# EAGLE design ESP-wroom-02U (EAGLE 9.6.2)
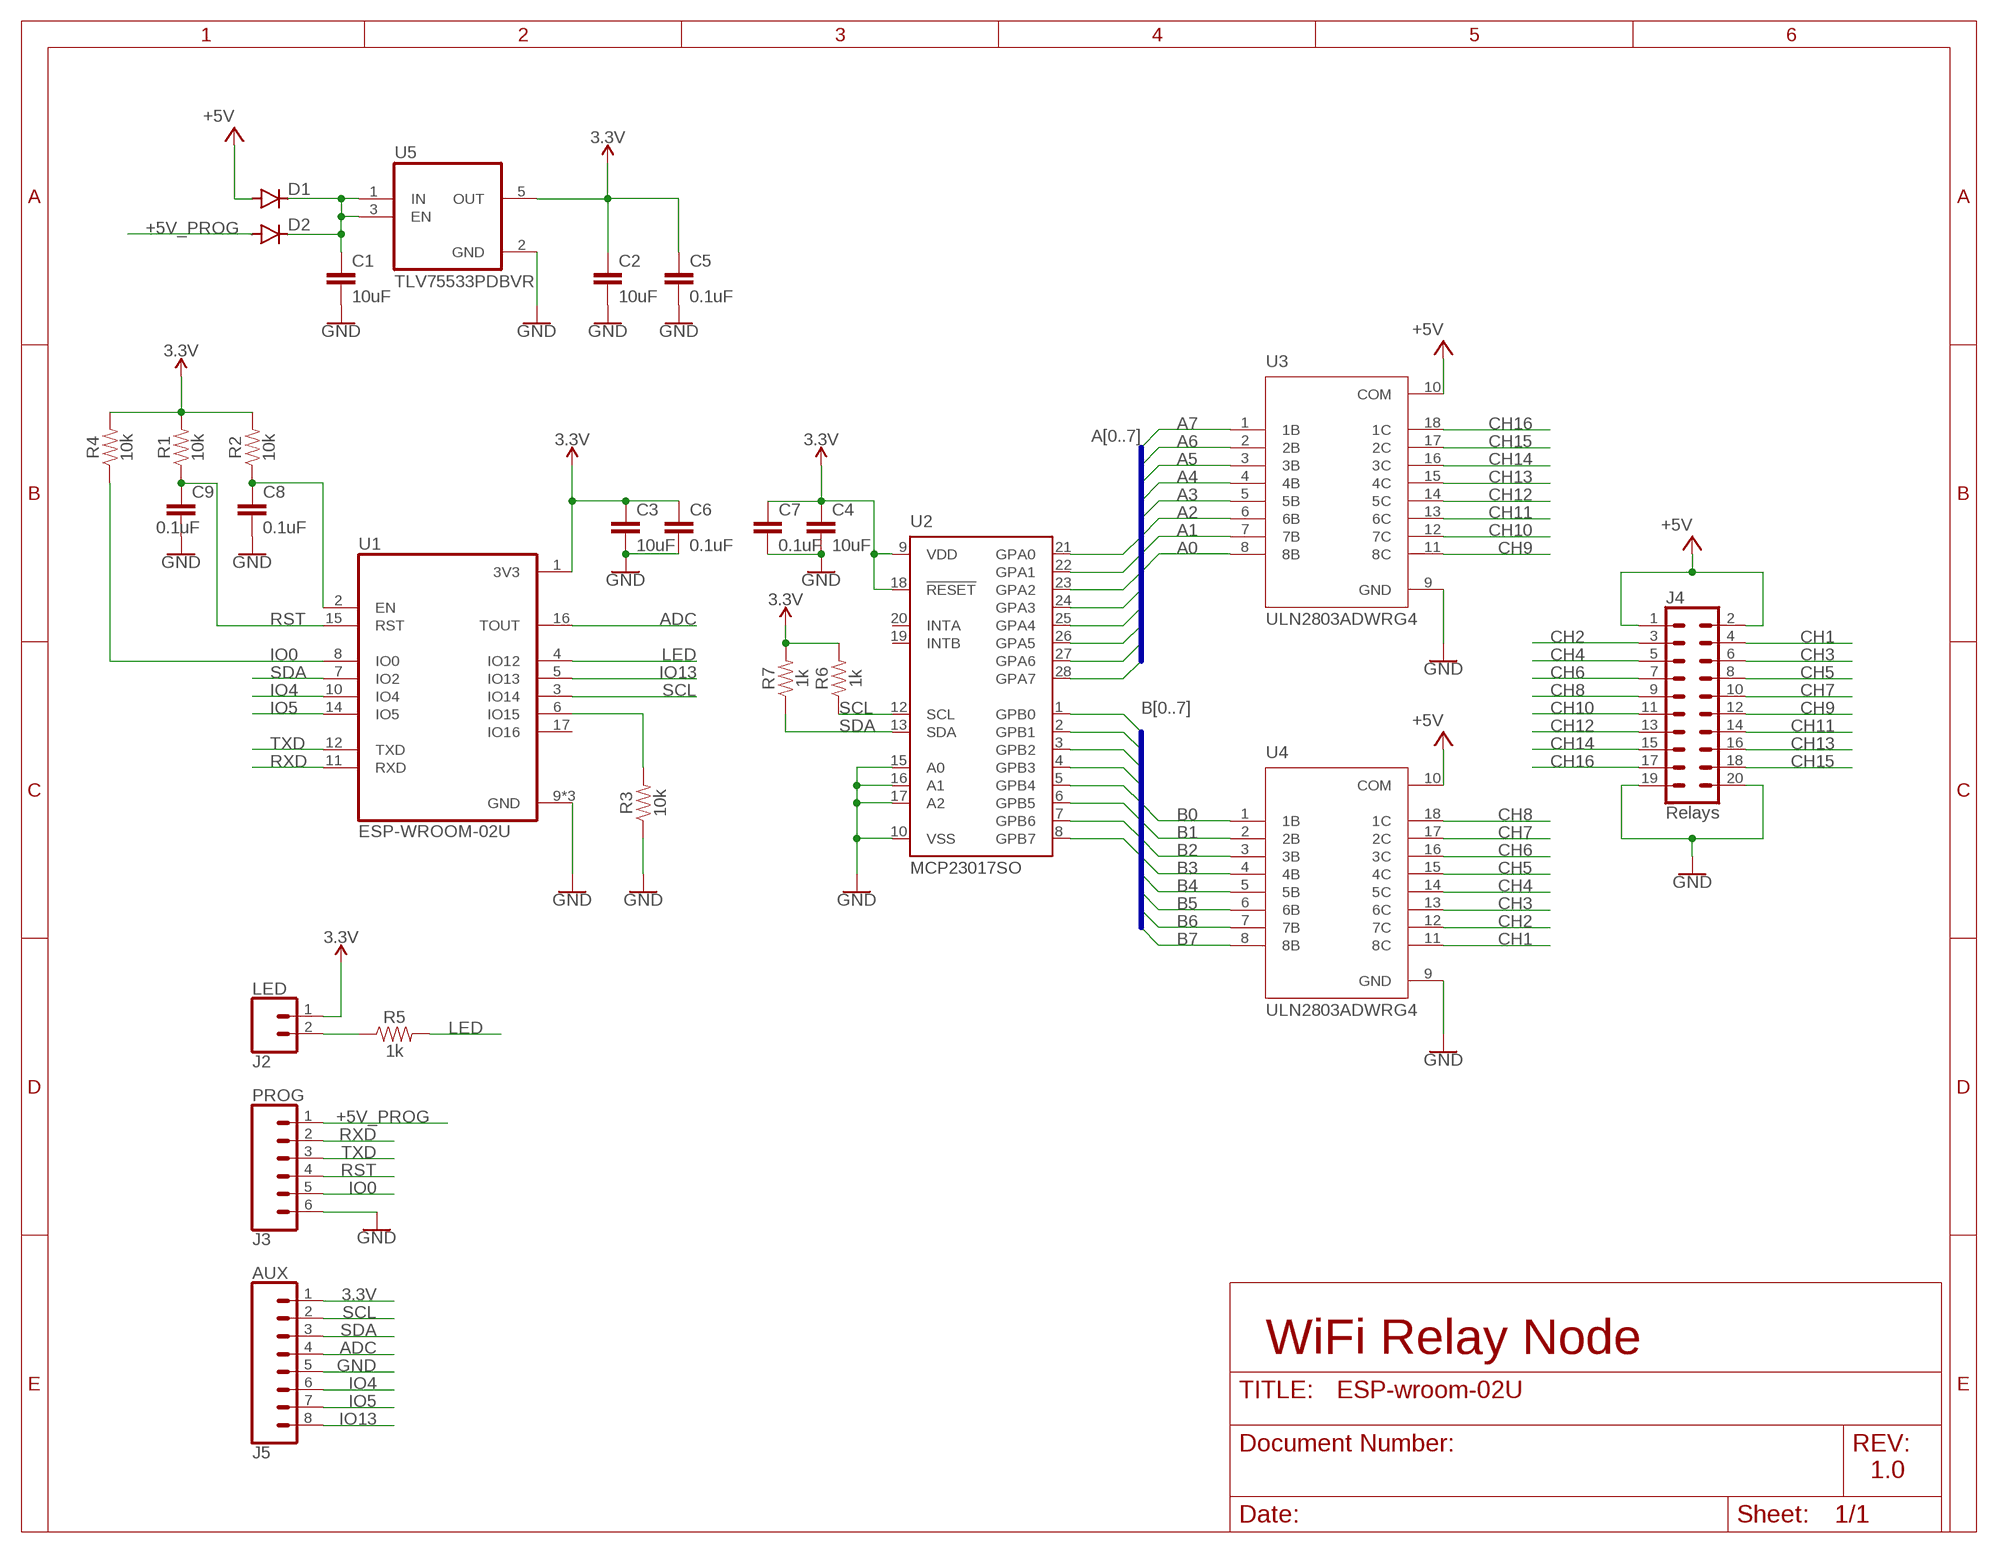
[diagram p0: schematic, sheet 1]

## Parts
C1  10uF  10UF-0805-25V-10%  [0805]
C2  10uF  10UF-0805-25V-10%  [0805]
C3  10uF  10UF-0805-25V-10%  [0805]
C4  10uF  10UF-0805-25V-10%  [0805]
C5  0.1uF  0.1UF-0603-25V-5%  [0603]
C6  0.1uF  0.1UF-0603-25V-5%  [0603]
C7  0.1uF  0.1UF-0603-25V-5%  [0603]
C8  0.1uF  0.1UF-0603-25V-5%  [0603]
C9  0.1uF  0.1UF-0603-25V-5%  [0603]
D1  MBR0520LT  [SOD123]
D2  MBR0520LT  [SOD123]
J2  LED  CONN_02  [1X02]
J3  PROG  CONN_06SILK_FEMALE_PTH  [1X06]
J4  Relays  CONN_10X2  [2X10]
J5  AUX  CONN_08"  [1X08]
R1  10k  10KOHM-0603-1/10W-5%  [0603]
R2  10k  10KOHM-0603-1/10W-5%  [0603]
R3  10k  10KOHM-0603-1/10W-5%  [0603]
R4  10k  10KOHM-0603-1/10W-5%  [0603]
R5  1k  1KOHM-0603-1/10W-5%  [0603]
R6  1k  1KOHM-0603-1/10W-5%  [0603]
R7  1k  1KOHM-0603-1/10W-5%  [0603]
U1  ESP-WROOM-02U  [MODULE_ESP-WROOM-02U]
U2  MCP23017SO  [SO28W]
U3  ULN2803ADWRG4  [SOIC127P1030X265-18N]
U4  ULN2803ADWRG4  [SOIC127P1030X265-18N]
U5  TLV75533PDBVR  [SOT95P280X145-5N]

## Nets
3.3V: C2.1 C3.1 C4.1 C5.1 C6.1 C7.1 J2.1 J5.1 R1.2 R2.2 R4.2 R6.2 R7.2 U1.1(3V3) U2.9(VDD) U2.18(!RESET) U5.5(OUT)
+5V: D1.A J4.1 J4.2 U3.10(COM) U4.10(COM)
+5V_PROG: D2.A J3.1
A0: U2.21(GPA0) U3.8(8B)
A1: U2.22(GPA1) U3.7(7B)
A2: U2.23(GPA2) U3.6(6B)
A3: U2.24(GPA3) U3.5(5B)
A4: U2.25(GPA4) U3.4(4B)
A5: U2.26(GPA5) U3.3(3B)
A6: U2.27(GPA6) U3.2(2B)
A7: U2.28(GPA7) U3.1(1B)
ADC: J5.4 U1.16(TOUT)
B0: U2.1(GPB0) U4.1(1B)
B1: U2.2(GPB1) U4.2(2B)
B2: U2.3(GPB2) U4.3(3B)
B3: U2.4(GPB3) U4.4(4B)
B4: U2.5(GPB4) U4.5(5B)
B5: U2.6(GPB5) U4.6(6B)
B6: U2.7(GPB6) U4.7(7B)
B7: U2.8(GPB7) U4.8(8B)
CH1: J4.4 U4.11(8C)
CH2: J4.3 U4.12(7C)
CH3: J4.6 U4.13(6C)
CH4: J4.5 U4.14(5C)
CH5: J4.8 U4.15(4C)
CH6: J4.7 U4.16(3C)
CH7: J4.10 U4.17(2C)
CH8: J4.9 U4.18(1C)
CH9: J4.12 U3.11(8C)
CH10: J4.11 U3.12(7C)
CH11: J4.14 U3.13(6C)
CH12: J4.13 U3.14(5C)
CH13: J4.16 U3.15(4C)
CH14: J4.15 U3.16(3C)
CH15: J4.18 U3.17(2C)
CH16: J4.17 U3.18(1C)
GND: C1.2 C2.2 C3.2 C4.2 C5.2 C6.2 C7.2 C8.2 C9.2 J3.6 J4.19 J4.20 J5.5 R3.1 U1.9(GND) U1.13(GND) U1.18(GND) U2.10(VSS) U2.15(A0) U2.16(A1) U2.17(A2) U3.9(GND) U4.9(GND) U5.2(GND)
IO0: J3.5 R4.1 U1.8(IO0)
IO4: J5.6 U1.10(IO4)
IO5: J5.7 U1.14(IO5)
IO13: J5.8 U1.5(IO13)
LED: R5.2 U1.4(IO12)
N$1: C1.1 D1.C D2.C U5.1(IN) U5.3(EN)
N$2: R3.2 U1.6(IO15)
N$5: C8.1 R2.1 U1.2(EN)
N$6: J2.2 R5.1
RST: C9.1 J3.4 R1.1 U1.15(RST)
RXD: J3.2 U1.11(RXD)
SCL: J5.2 R6.1 U1.3(IO14) U2.12(SCL)
SDA: J5.3 R7.1 U1.7(IO2) U2.13(SDA)
TXD: J3.3 U1.12(TXD)
Unconnected: U1.17(IO16) U2.19(INTB) U2.20(INTA)

## Buses
B[0..7]
A[0..7]

## Notes on the sheet
- WiFi Relay Node
- 1.0

## Library data of the parts
C1-C4 = SFM-Project:10UF: 10.0µF ceramic capacitors A capacitor is a passive two-terminal electrical component used to store electrical energy temporarily in an electric field.; PROD_ID: CAP-14259
C5-C9 = SFM-Project:0.1UF: 0.1µF ceramic capacitors A capacitor is a passive two-terminal electrical component used to store electrical energy temporarily in an electric field.; PROD_ID: CAP-08604
D1 D2 = SFM-Project:MBR0520LT: SCHOTTKY BARRIER RECTIFIER Source: http://onsemi.com .. MBR0520LT1-D.pdf
J2 = SFM-Project:CONN_02: Multi connection point. Often used as Generic Header-pin footprint for 0.1 inch spaced/style header connections On any of the 0.1 inch spaced packages, you can populate with these: Break Away Headers - Straight <https://www.sparkfun.com/products/116> (PRT-00116) Break Away Male Headers - Right Angle <https://www.sparkfun.com/products/553> (PRT-00553) Female Headers <https://www.sparkfun.com/products/115> (PRT-00115) Break Away Headers - Machine Pin <https://www.sparkfun.com/products/117> (PRT-00117) Break Away Female Headers - Swiss Machine Pin <https://www.sparkfun.com/products/743> (PRT-00743) For SCREWTERMINALS and SPRING TERMINALS visit here: Screw Terimnals on SparkFun.com <https://www.sparkfun.com/search/results?term=Screw+Terminals> (5mm/3.5mm/2.54mm spacing) This device is also useful as a general connection point to wire up your design to another part of your project. Our various solder wires solder well into these plated through hole pads. Hook-Up Wire - Assortment (Stranded, 22 AWG) <https://www.sparkfun.com/products/11375> (PRT-11375) Hook-Up Wire - Assortment (Solid Core, 22 AWG) <https://www.sparkfun.com/products/11367> (PRT-11367) View the entire wire category on our website here <https://www.sparkfun.com/categories/141> Special notes: Molex polarized connector foot print use with: PRT-08233 with associated crimp pins and housings. 2.54_SCREWTERM for use with PRT-10571. 3.5mm Screw Terminal footprints for PRT-08084 5mm Screw Terminal footprints for use with PRT-08432
J3 = SFM-Project:CONN_06: Multi connection point. Often used as Generic Header-pin footprint for 0.1 inch spaced/style header connections On any of the 0.1 inch spaced packages, you can populate with these: Break Away Headers - Straight <https://www.sparkfun.com/products/116> (PRT-00116) Break Away Male Headers - Right Angle <https://www.sparkfun.com/products/553> (PRT-00553) Female Headers <https://www.sparkfun.com/products/115> (PRT-00115) Break Away Headers - Machine Pin <https://www.sparkfun.com/products/117> (PRT-00117) Break Away Female Headers - Swiss Machine Pin <https://www.sparkfun.com/products/743> (PRT-00743) Arduino Stackable Header - 6 Pin <https://www.sparkfun.com/products/9280> (PRT-09280) For SCREWTERMINALS and SPRING TERMINALS visit here: Screw Terimnals on SparkFun.com <https://www.sparkfun.com/search/results?term=Screw+Terminals> (5mm/3.5mm/2.54mm spacing) This device is also useful as a general connection point to wire up your design to another part of your project. Our various solder wires solder well into these plated through hole pads. Hook-Up Wire - Assortment (Stranded, 22 AWG) <https://www.sparkfun.com/products/11375> (PRT-11375) Hook-Up Wire - Assortment (Solid Core, 22 AWG) <https://www.sparkfun.com/products/11367> (PRT-11367) View the entire wire category on our website here <https://www.sparkfun.com/categories/141>; PROD_ID: CONN-08437
J4 = SFM-Project:CONN_10X2: Multi connection point. Often used as Generic Header-pin footprint for 0.1 inch spaced/style header connections On any of the 0.1 inch spaced packages, you can populate with these: Break Away Headers - Straight <https://www.sparkfun.com/products/116> (PRT-00116) Break Away Male Headers - Right Angle <https://www.sparkfun.com/products/553> (PRT-00553) Female Headers <https://www.sparkfun.com/products/115> (PRT-00115) Break Away Headers - Machine Pin <https://www.sparkfun.com/products/117> (PRT-00117) Break Away Female Headers - Swiss Machine Pin <https://www.sparkfun.com/products/743> (PRT-00743) Special note about the "SPECIAL" package: This was SPECIALLY designed to be used with our Graphic LCD Backpack. Be sure you want to use this! It is not only staggered on each line of header holes, but IT IS ALSO offset of the center point of the top and bottom lines by 5 mil. This causes the headers to lock into place on the "standard" footprint on the LCD screen. The extra squares on the tdocu layer are there simply to reference other pins (if you were to actually populate a longer header than ten long - this is what we do with the backpacks).
J5 = SFM-Project:CONN_08: Multi connection point. Often used as Generic Header-pin footprint for 0.1 inch spaced/style header connections On any of the 0.1 inch spaced packages, you can populate with these: Break Away Headers - Straight <https://www.sparkfun.com/products/116> (PRT-00116) Break Away Male Headers - Right Angle <https://www.sparkfun.com/products/553> (PRT-00553) Female Headers <https://www.sparkfun.com/products/115> (PRT-00115) Break Away Headers - Machine Pin <https://www.sparkfun.com/products/117> (PRT-00117) Break Away Female Headers - Swiss Machine Pin <https://www.sparkfun.com/products/743> (PRT-00743) Arduino Stackable Header - 8 Pin <https://www.sparkfun.com/products/9279> (PRT-09279) For SCREWTERMINALS and SPRING TERMINALS visit here: Screw Terimnals on SparkFun.com <https://www.sparkfun.com/search/results?term=Screw+Terminals> (5mm/3.5mm/2.54mm spacing) This device is also useful as a general connection point to wire up your design to another part of your project. Our various solder wires solder well into these plated through hole pads. Hook-Up Wire - Assortment (Stranded, 22 AWG) <https://www.sparkfun.com/products/11375> (PRT-11375) Hook-Up Wire - Assortment (Solid Core, 22 AWG) <https://www.sparkfun.com/products/11367> (PRT-11367) View the entire wire category on our website here <https://www.sparkfun.com/categories/141> Special notes: Molex polarized connector foot print use with SKU : PRT-08231 with associated crimp pins and housings. 1MM SMD Version SKU: PRT-10208 NOTES ON THE VARIANTS LOCK and LOCK_LONGPADS... This footprint was designed to help hold the alignment of a through-hole component (i.e. 6-pin header) while soldering it into place. You may notice that each hole has been shifted either up or down by 0.005 of an inch from it's more standard position (which is a perfectly straight line). This slight alteration caused the pins (the squares in the middle) to touch the edges of the holes. Because they are alternating, it causes a "brace" to hold the component in place. 0.005 has proven to be the perfect amount of "off-center" position when using our standard breakaway headers. Although looks a little odd when you look at the bare footprint, once you have a header in there, the alteration is very hard to notice. Also,if you push a header all the way into place, it is covered up entirely on the bottom side.; PROD_ID: CONN-08438
R1-R4 = SFM-Project:10KOHM: 10kΩ resistor A resistor is a passive two-terminal electrical component that implements electrical resistance as a circuit element. Resistors act to reduce current flow, and, at the same time, act to lower voltage levels within circuits. - Wikipedia; PROD_ID: RES-09231
R5-R7 = SFM-Project:1KOHM: 1kΩ resistor A resistor is a passive two-terminal electrical component that implements electrical resistance as a circuit element. Resistors act to reduce current flow, and, at the same time, act to lower voltage levels within circuits. - Wikipedia; PROD_ID: RES-09231
U1 = SFM-Project:ESP-WROOM-02U: Module: WiFi; GPIO, I2C, I2S, PWM, SDIO, SPI, UART; U.FL; 2.7÷3.6VDC; AVAILABILITY: Unavailable; DESCRIPTION: WiFi 802.11b/g/n Transceiver Module 2.4GHz ~ 2.5GHz Integrated, Chip + IPEX Surface Mount; MF: Espressif Systems; MP: ESP-WROOM-02U; PACKAGE: SMD-18 Espressif Systems; PRICE: None
U2 = SFM-Project:MCP23017: http://ww1.microchip.com/downloads/en/DeviceDoc/21952a.pdf Source: http://ww1.microchip.com/downloads/en/DeviceDoc/21952a.pdf; MF: MICROCHIP; MPN: MCP23017-E/SO; OC_FARNELL: 1332087; OC_NEWARK: 31K2958
U3 U4 = SFM-Project:ULN2803ADWRG4: Trans Darlington NPN 50V 0.5A 18-Pin SOIC T/R; DESCRIPTION: Bipolar _BJT_ Transistor Array 8 NPN Darlington 50V 500mA Surface Mount 18-SOIC; DIGI-KEY_PART_NUMBER: 296-35964-1-ND; DIGI-KEY_PURCHASE_URL: https://www.digikey.com/product-detail/en/texas-instruments/ULN2803ADWRG4/296-35964-1-ND/4134939?utm_source=snapeda&utm_medium=aggregator&utm_campaign=symbol; MF: Texas Instruments; MP: ULN2803ADWRG4; PACKAGE: SOIC-18 Texas Instruments
U5 = SFM-Project:TLV75533PDBVR: 500mA Low-IQ Small-Size Low-Dropout (LDO) Regulator 5-SOT-23 -40 to 125; DESCRIPTION: Linear Voltage Regulator IC 1 Output 500mA SOT-23-5; DIGI-KEY_PART_NUMBER: 296-50411-1-ND; DIGI-KEY_PURCHASE_URL: https://www.digikey.com/product-detail/en/texas-instruments/TLV75533PDBVR/296-50411-1-ND/9685550?utm_source=snapeda&utm_medium=aggregator&utm_campaign=symbol; MF: Texas Instruments; MP: TLV75533PDBVR; PACKAGE: SOT-23 Texas Instruments

## Board
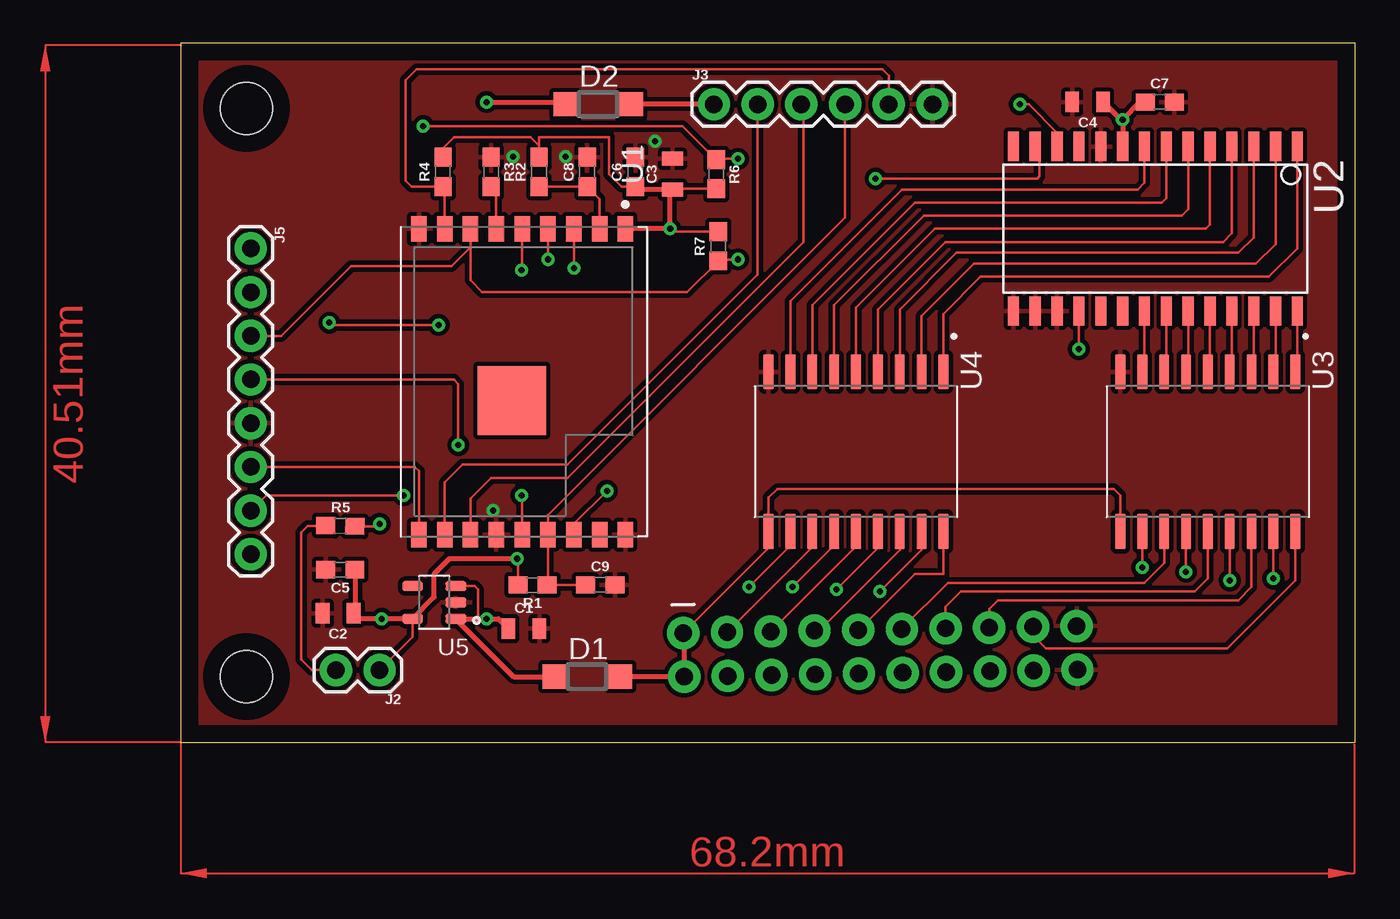
[diagram p1: board, top side]
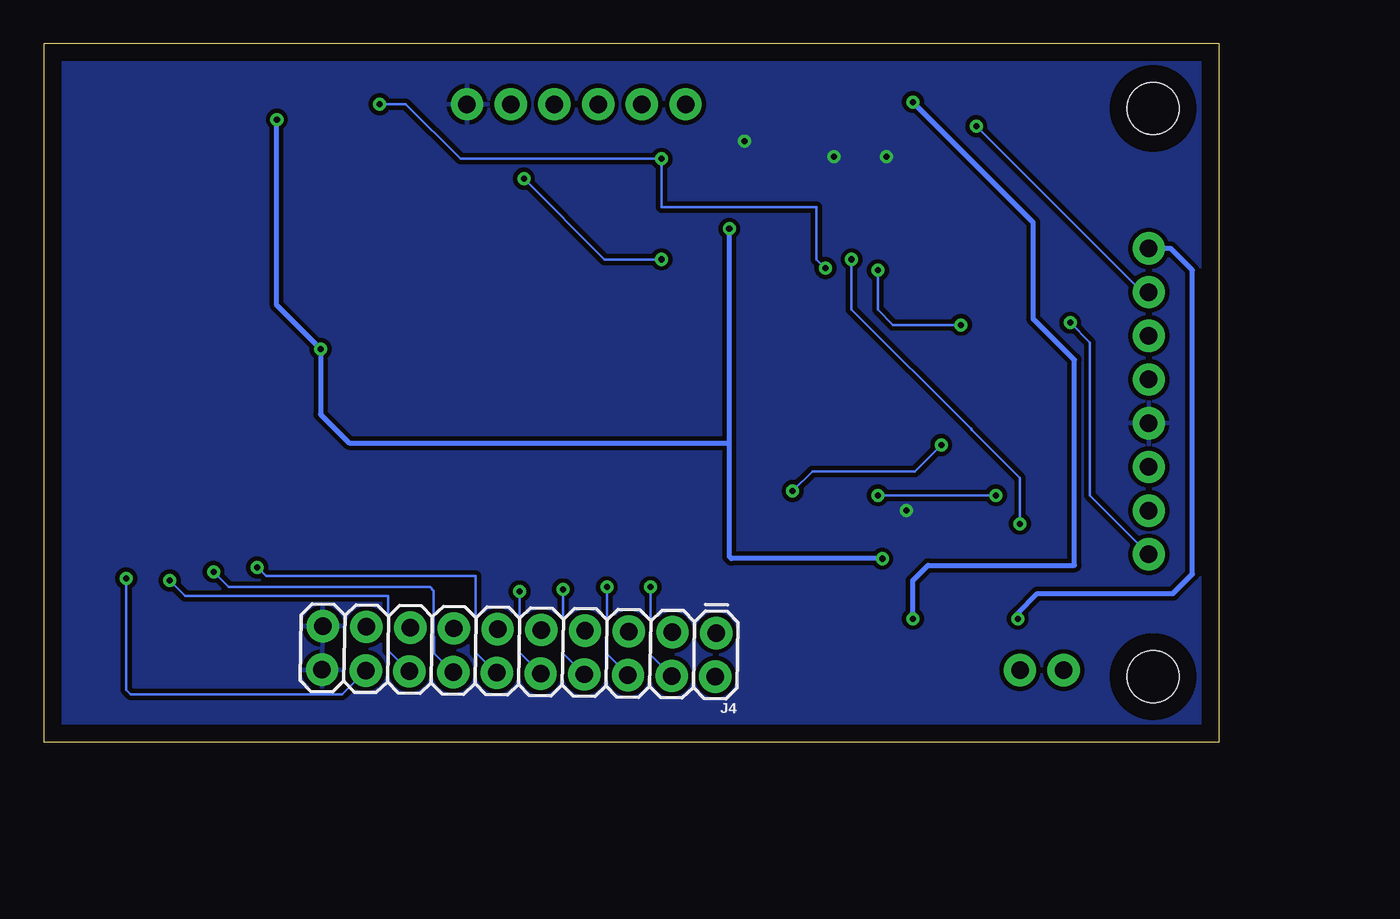
[diagram p2: board, bottom side, seen from below]

Size 68.25 x 40.63 mm. Coordinates in mm from the lower left corner, seen from the top.
Outline: 0,0 68.25,0 68.25,40.63 0,40.63 0,0
Copper layers (1*16): Top 0.035mm / dielectric 1.5mm / Bottom 0.035mm
Design rules "default": minimum track width 6mil, minimum drill 0.35mm, track to track 6mil, track to pad 6mil, pad to pad 6mil, via to via 6mil, smd to smd 6mil, copper to edge 40mil, drill to drill 6mil, minimum pad ring 10mil, minimum via ring 8mil, stop-mask expansion 4mil, vias tented up to drill 0mil, thermal gap 10mil
Holes 3 mm at 3.81,3.81 3.81,36.83

### Footprints (pad centres in the part's own frame; a part is rotated, then mirrored left to right if it is on the bottom)
0805 = smd 0.8 x 1.2: 1 -0.9,0; 2 0.9,0
0603 = smd 1.1 x 1: 1 -0.85,0; 2 0.85,0
SOD123 = smd 1.4 x 1.4: A 1.9,0; C -1.9,0
1X02 = drill 1.016 pad 1.88: 1 0,0; 2 2.54,0
1X06 = drill 1.016 pad 1.88: 1 0,0; 2 2.54,0; 3 5.08,0; 4 7.62,0; 5 10.16,0; 6 12.7,0
2X10 = drill 1.016 pad 1.88: 1 0,0; 2 0,2.54; 3 2.54,0; 4 2.54,2.54; 5 5.08,0; 6 5.08,2.54; 7 7.62,0; 8 7.62,2.54; 9 10.16,0; 10 10.16,2.54; 11 12.7,0; 12 12.7,2.54; 13 15.24,0; 14 15.24,2.54; 15 17.78,0; 16 17.78,2.54; 17 20.32,0; 18 20.32,2.54; 19 22.86,0; 20 22.86,2.54
1X08 = drill 1.016 pad 1.88: 1 0,0; 2 2.54,0; 3 5.08,0; 4 7.62,0; 5 10.16,0; 6 12.7,0; 7 15.24,0; 8 17.78,0
MODULE_ESP-WROOM-02U = smd 1.485 x 0.9: 1 -8.893,5.9; 2 -8.893,4.4; 3 -8.893,2.9; 4 -8.893,1.4; 5 -8.893,-0.1; 6 -8.893,-1.6; 7 -8.893,-3.1; 8 -8.893,-4.6; 9 -8.893,-6.1; 10 8.893,-6.1; 11 8.893,-4.6; 12 8.893,-3.1; 13 8.893,-1.6; 14 8.893,-0.1; 15 8.893,1.4; 16 8.893,2.9; 17 8.893,4.4; 18 8.893,5.9 | smd 4 x 4: 19 1.1,-0.7
SO28W = smd 0.65 x 1.7: 1 -7.62,-4.78; 2 -6.35,-4.78; 3 -5.08,-4.78; 4 -3.81,-4.78; 5 -2.54,-4.78; 6 -1.27,-4.78; 7 0,-4.78; 8 1.27,-4.78; 9 2.54,-4.78; 10 3.81,-4.78; 11 5.08,-4.78; 12 6.35,-4.78; 13 7.62,-4.78; 14 8.89,-4.78; 15 8.89,4.78; 16 7.62,4.78; 17 6.35,4.78; 18 5.08,4.78; 19 3.81,4.78; 20 2.54,4.78; 21 1.27,4.78; 22 0,4.78; 23 -1.27,4.78; 24 -2.54,4.78; 25 -3.81,4.78; 26 -5.08,4.78; 27 -6.35,4.78; 28 -7.62,4.78
SOIC127P1030X265-18N = smd 2.06 x 0.6: 1 -4.64,5.08; 2 -4.64,3.81; 3 -4.64,2.54; 4 -4.64,1.27; 5 -4.64,0; 6 -4.64,-1.27; 7 -4.64,-2.54; 8 -4.64,-3.81; 9 -4.64,-5.08; 10 4.64,-5.08; 11 4.64,-3.81; 12 4.64,-2.54; 13 4.64,-1.27; 14 4.64,0; 15 4.64,1.27; 16 4.64,2.54; 17 4.64,3.81; 18 4.64,5.08
SOT95P280X145-5N = smd 1.21 x 0.59: 1 -1.255,0.95; 2 -1.255,0; 3 -1.255,-0.95; 4 1.255,-0.95; 5 1.255,0.95

### Placement (x,y rotation side)
C1  19.94,6.6 0 top
C2  9.14,7.49 180 top
C3  28.57,33.02 90 top
C4  52.7,37.21 180 top
C5  9.27,10.03 180 top
C6  26.42,33.15 90 top
C7  56.9,37.21 0 top
C8  23.62,33.15 90 top
C9  24.38,9.14 0 top
D1  23.62,3.81 0 top
D2  24.26,37.08 0 top
J2  11.56,4.19 180 top
J3  30.99,37.08 0 top
J4  29.21,6.35 179 bottom
J5  4.06,28.7 270 top
R1  20.45,9.14 180 top
R2  20.83,33.15 90 top
R3  18.03,33.15 270 top
R4  15.24,33.15 90 top
R5  9.27,12.57 358.8 top
R6  31.11,33.02 270 top
R7  31.24,28.83 90 top
U1  19.94,20.95 270 top
U2  57.28,29.84 180 top
U3  59.69,16.89 270 top
U4  39.24,16.89 270 top
U5  14.73,8.13 180 top

### Tracks (layer width: path | path; a pad name or v marks a point on that pad's centre or on a via)
3.3V  (via drill 0.35)
  Top 0.152: U5.5 13.48,6.11 J2.1 | R1.2 19.6,10.63 v19.56,10.67 | R6.2 28.62,32.17 C3.1 | R4.2 15.24,34.54 15.88,35.18 20.32,35.18 20.83,34.67 R2.2 20.83,35.18 24.89,35.18 24.89,33.02 25.61,32.3 C6.1 | R7.2 28.49,29.68 28.32,29.84 | U2.18 v52.2,22.86
  Top 0.2: 10.1,7.43 C2.1
  Top 0.305: 10.1,7.43 10.36,7.18 v11.68,7.18 U5.5 14.73,8.43 14.73,9.78 15.62,10.67 v19.56,10.67 | C5.1 10.12,7.57 C2.1 | U1.1 28.32,29.84 v28.45,29.84 28.45,31.99 C3.1 26.59,32.12 C6.1 | v54.74,36.2 U2.9 | v54.74,36.2 55.75,37.21 C7.1 | v54.74,36.2 54.62,36.2 C4.1
  Bottom 0.305: v19.56,10.67 28.32,10.67 28.45,10.79 28.45,17.4 | 28.45,17.4 v28.45,29.84 | 28.45,17.4 50.55,17.4 52.2,19.05 v52.2,22.86 54.74,25.4 v54.74,36.2 | v11.68,7.18 11.68,7.49 10.54,8.64 2.67,8.64 1.52,9.78 1.52,27.43 2.79,28.7 J5.1
+5V
  Top 0.152: J4.1 34.16,11.3 U4.10 34.16,14.22 34.67,14.73 54.23,14.73 54.61,14.35 U3.10 | J4.2
  Top 0.305: D1.A J4.2 29.25,6.31 J4.1 | D1.A
+5V_PROG
  Top 0.305: J3.1 D2.A
A0
  Top 0.152: U2.21 56.01,21.66 U3.8
A1
  Top 0.152: U2.22 57.28,21.66 U3.7
A2
  Top 0.152: U2.23 58.55,21.66 U3.6
A3
  Top 0.152: U2.24 59.82,21.66 U3.5
A4
  Top 0.152: U2.25 61.09,21.66 U3.4
A5
  Top 0.152: U2.26 62.36,21.66 U3.3
A6
  Top 0.152: U2.27 63.63,21.66 U3.2
A7
  Top 0.152: U2.28 64.9,21.66 U3.1
ADC  (via drill 0.35)
  Top 0.152: J5.4 15.88,21.08 16.13,20.83 v16.13,17.27 | v24.77,14.61 22.84,12.68 U1.16
  Bottom 0.152: v16.13,17.27 17.65,15.75 23.62,15.75 v24.77,14.61
B0
  Top 0.152: U2.1 64.9,28.7 63.25,27.05 46.48,27.05 44.32,24.89 U4.1
B1
  Top 0.152: U2.2 63.63,28.96 62.48,27.81 46.1,27.81 43.05,24.77 U4.2
B2
  Top 0.152: U2.3 62.36,29.34 61.47,28.45 45.09,28.45 41.78,25.15 U4.3
B3
  Top 0.152: U2.4 61.09,29.59 60.58,29.08 44.45,29.08 40.51,25.15 U4.4
B4
  Top 0.152: U2.5 59.82,30.1 59.56,29.84 43.81,29.84 39.24,25.27 U4.5
B5
  Top 0.152: U2.6 58.55,30.99 58.17,30.61 43.18,30.61 37.97,25.4 U4.6
B6
  Top 0.152: U2.7 57.28,31.62 57.02,31.37 42.67,31.37 36.7,25.4 U4.7
B7
  Top 0.152: U2.8 56.01,32.51 55.63,32.13 41.91,32.13 35.43,25.65 U4.8
CH1  (via drill 0.35)
  Top 0.152: U4.11 35.43,11.43 v33.02,9.02
  Bottom 0.152: v33.02,9.02 33.02,5.08 J4.4
CH2
  Top 0.152: U4.12 36.7,11.35 J4.3
CH3  (via drill 0.35)
  Top 0.152: U4.13 37.97,11.43 v35.56,9.02
  Bottom 0.152: v35.56,9.02 35.56,5.12 J4.6
CH4
  Top 0.152: U4.14 39.24,11.39 J4.5
CH5  (via drill 0.35)
  Top 0.152: U4.15 40.51,11.3 v38.1,8.89
  Bottom 0.152: v38.1,8.89 38.1,5.17 J4.8
CH6
  Top 0.152: U4.16 41.78,11.18 37.09,6.48 J4.7
CH7  (via drill 0.35)
  Top 0.152: U4.17 43.05,11.18 v40.64,8.76
  Bottom 0.152: v40.64,8.76 40.64,5.21 J4.10
CH8
  Top 0.152: U4.18 44.32,9.78 42.67,9.78 39.42,6.53 J4.9
CH9  (via drill 0.35)
  Top 0.152: U3.11 v55.88,10.16
  Bottom 0.152: v55.88,10.16 55.37,9.65 43.18,9.65 43.18,5.21 42.01,4.03 J4.12
CH10
  Top 0.152: U3.12 57.15,10.41 56.01,9.27 44.58,9.27 41.91,6.6 J4.11
CH11  (via drill 0.35)
  Top 0.152: U3.13 v58.42,9.91
  Bottom 0.152: v58.42,9.91 57.53,9.02 45.85,9.02 45.62,8.79 45.62,6.15 45.59,6.12 45.59,5.18 J4.14
CH12
  Top 0.152: U3.14 59.69,9.53 58.93,8.76 45.34,8.76 44.45,7.87 J4.13
CH13  (via drill 0.35)
  Top 0.152: U3.15 v60.96,9.4
  Bottom 0.152: v60.96,9.4 60.07,8.51 48.26,8.51 48.26,5.33 47.05,4.12 J4.16
CH14
  Top 0.152: U3.16 62.23,9.02 61.47,8.26 47.5,8.26 46.99,7.74 J4.15
CH15  (via drill 0.35)
  Top 0.152: U3.17 v63.5,9.53
  Bottom 0.152: v63.5,9.53 63.5,3.05 63.25,2.79 50.94,2.79 J4.18
CH16
  Top 0.152: U3.18 64.77,9.4 60.83,5.46 50.29,5.46 49.53,6.23 J4.17
GND  (via drill 0.35)
  other vias: 19.3,34.04 18.16,13.46 22.35,34.04 27.56,34.92
  pour Top (isolate 0.254): 0,0 0,40.64 68.33,40.64 68.33,0
  pour Bottom (isolate 0.254): 0,0 0,40.51 0.13,40.51 68.2,40.51 68.2,0
IO0
  Top 0.152: U1.8 15.34,32.2 R4.1 13.42,32.3 13.08,32.64 13.08,38.48 13.72,39.12 40.77,39.12 41.15,38.73 J3.5
IO4
  Top 0.152: U1.10 13.84,15.75 13.59,16 J5.6
IO5  (via drill 0.35)
  Top 0.152: U1.14 19.84,14.32 v19.81,14.35 | v12.95,14.35 4.95,14.35 J5.7
  Bottom 0.152: v19.81,14.35 v12.95,14.35
IO13  (via drill 0.35)
  Top 0.152: U1.5 19.84,27.46 v19.81,27.43 | v14.99,24.26 8.76,24.26 v8.64,24.38
  Bottom 0.152: v19.81,27.43 19.81,25.15 18.92,24.26 v14.99,24.26 | v8.64,24.38 7.49,23.24 7.49,14.35 J5.8
LED  (via drill 0.35)
  Top 0.152: U1.4 v21.34,28.07 | v11.56,12.7 11.41,12.55 R5.2
  Bottom 0.152: v21.34,28.07 21.34,25.15 14.41,18.22 14.35,18.16 11.56,15.37 v11.56,12.7
N$1  (via drill 0.35)
  Top 0.152: U5.3 17.08,9.08 17.27,8.89 17.27,7.18
  Top 0.305: D1.C 19.36,3.81 U5.1 17.27,7.18 v17.78,7.18 18.46,7.18 C1.1 | D2.C 22.23,37.21 v17.78,37.21
  Bottom 0.305: v17.78,37.21 10.79,30.23 10.79,24.64 8.38,22.23 8.38,10.29 16.89,10.29 17.78,9.4 v17.78,7.18
N$2
  Top 0.152: R3.2 18.34,31.99 U1.6
N$5
  Top 0.152: U1.2 24.34,31.58 C8.1 R2.1
N$6
  Top 0.152: R5.1 8.4,12.57 7.37,12.57 6.99,12.19 6.99,4.83 7.62,4.19 J2.2
RST
  Top 0.152: U1.15 21.34,11.94 | 21.34,11.94 21.34,9.19 R1.1 C9.1 | J3.4 38.61,30.48 21.34,13.21 21.34,11.94
RXD
  Top 0.152: J3.2 33.53,27.18 22.48,16.13 16.38,16.13 15.34,15.09 U1.11
SCL  (via drill 0.35)
  Top 0.152: U2.12 50.93,35.43 49.28,37.08 v48.77,37.08 | v32.38,33.91 31.15,33.91 R6.1 29.17,35.81 v14.1,35.81 | v22.86,27.56 22.86,29.83 U1.3
  Bottom 0.152: v48.77,37.08 47.24,37.08 44.07,33.91 v32.38,33.91 32.38,31.11 23.37,31.11 23.37,28.07 v22.86,27.56 | v14.1,35.81 4.45,26.16 J5.2
SDA  (via drill 0.35)
  Top 0.152: U2.13 49.91,34.37 49.91,32.89 49.78,32.77 v40.39,32.77 | v32.38,28.07 31.33,28.07 R7.1 29.43,26.16 17.53,26.16 16.84,26.85 16.84,28.78 | 16.89,29.8 U1.7 16.84,29.72 16.84,28.78 | J5.3 5.84,23.62 9.91,27.69 15.75,27.69 16.84,28.78
  Bottom 0.152: v40.39,32.77 35.69,28.07 v32.38,28.07
TXD
  Top 0.152: J3.3 36.2,36.96 36.2,29.84 36.2,29.72 36.2,29.08 22.48,15.37 18.03,15.37 16.84,14.17 U1.12
(copper drawn outside any net)
  shapes: Top area x2